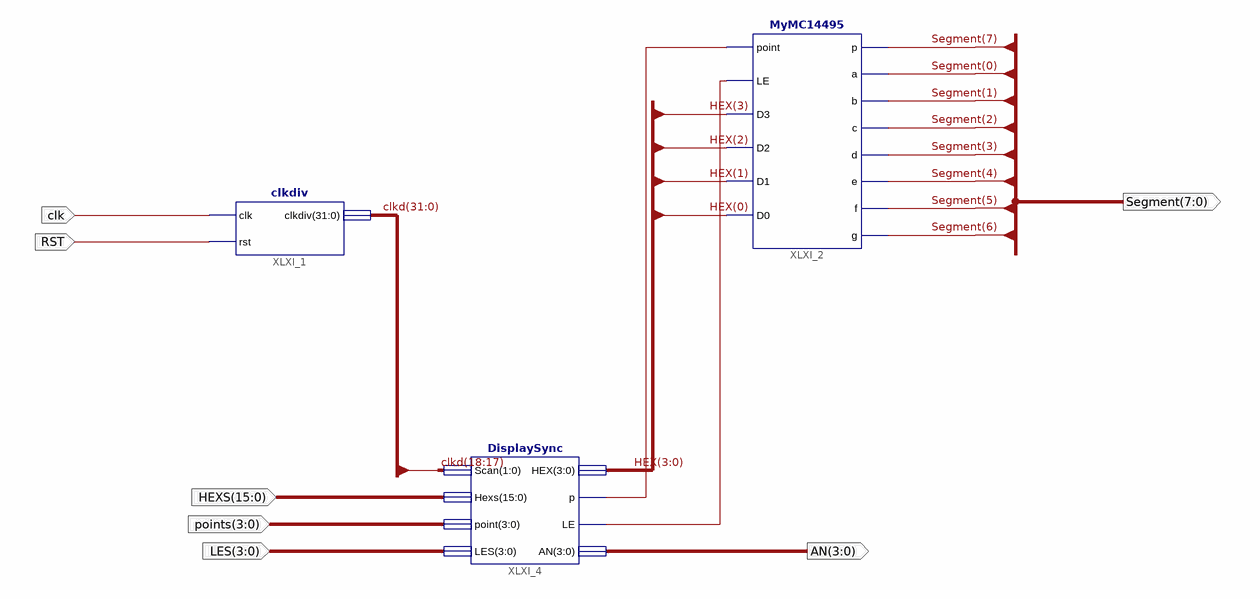
[diagram p0: schematic sheet 1]
// Xilinx ISE schematic disp_num.sch (kintex7) as structural Verilog: 3 symbols, 7 ports
module disp_num (
  input  clk,
  input  RST,
  input  [15:0] HEXS,
  input  [3:0] points,
  input  [3:0] LES,
  output [3:0] AN,
  output [7:0] Segment
);

  wire XLXN_8, XLXN_9;
  wire [3:0] HEX;
  wire [31:0] clkd;

  clkdiv XLXI_1 (.clk(clk), .rst(RST), .clkdiv(clkd));
  MyMC14495 XLXI_2 (
    .point(XLXN_8), .LE(XLXN_9), .D3(HEX[3]), .D2(HEX[2]), .D1(HEX[1]), .D0(HEX[0]), .p(Segment[7]),
    .a(Segment[0]), .b(Segment[1]), .c(Segment[2]), .d(Segment[3]), .e(Segment[4]), .f(Segment[5]),
    .g(Segment[6]));
  DisplaySync XLXI_4 (
    .Scan(clkd[18:17]), .Hexs(HEXS), .point(points), .LES(LES), .HEX(HEX), .p(XLXN_8), .LE(XLXN_9), .AN(AN));
endmodule
